# EAGLE design scarab-shield (EAGLE 8.3.1)
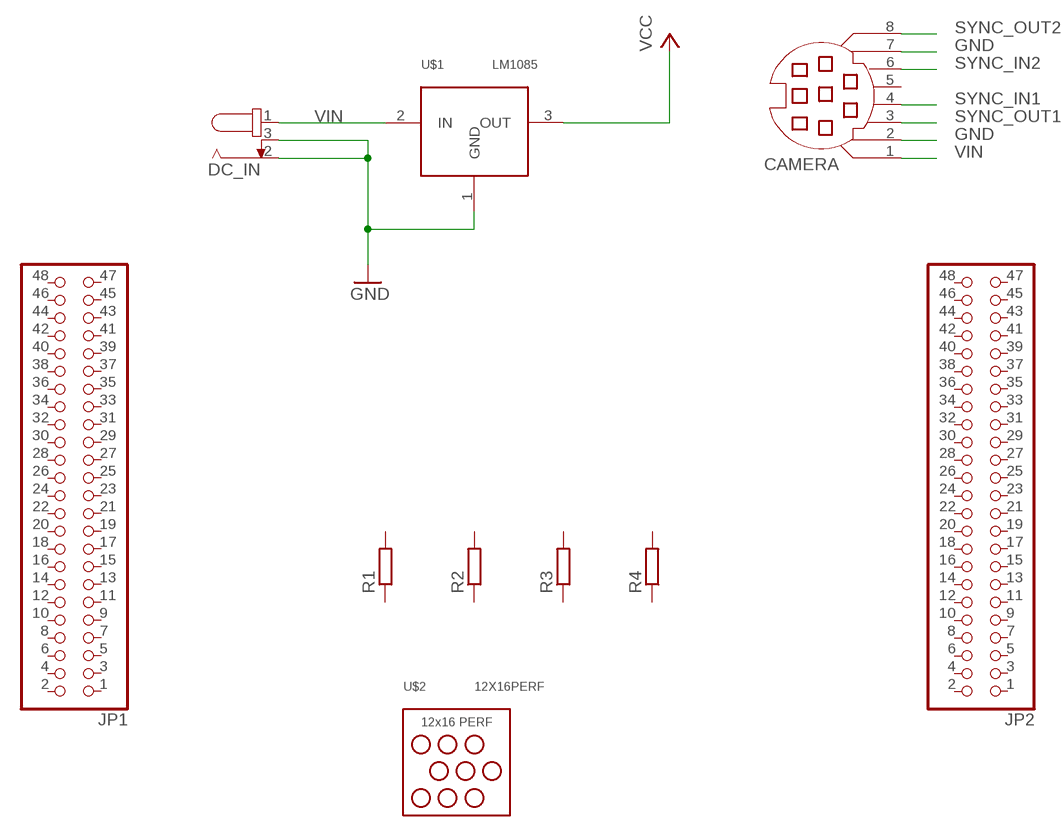
[diagram p0: schematic, sheet 1]

## Parts
CAMERA  MD08SS  [MDIN08SS]
DC_IN  694106105102  [694106105102]
JP1  PINHD-2X24  [2X24]
JP2  PINHD-2X24  [2X24]
R1  R-EU_M1206  [M1206]
R2  R-EU_M1206  [M1206]
R3  R-EU_M1206  [M1206]
R4  R-EU_M1206  [M1206]
U$1  LM1085  [TO263]
U$2  12X16PERF  [PERF-GRID]

## Nets
GND: CAMERA.2 CAMERA.7 DC_IN.2 DC_IN.3 U$1.1(GND)
SYNC_IN1: CAMERA.4
SYNC_IN2: CAMERA.6
SYNC_OUT1: CAMERA.3
SYNC_OUT2: CAMERA.8
VCC: U$1.3(OUT)
VIN: CAMERA.1 DC_IN.1 U$1.2(IN)
Unconnected: CAMERA.5 JP1.1 JP1.2 JP1.3 JP1.4 JP1.5 JP1.6 JP1.7 JP1.8 JP1.9 JP1.10 JP1.11 JP1.12 JP1.13 JP1.14 JP1.15 JP1.16 JP1.17 JP1.18 JP1.19 JP1.20 JP1.21 JP1.22 JP1.23 JP1.24 JP1.25 JP1.26 JP1.27 JP1.28 JP1.29 JP1.30 JP1.31 JP1.32 JP1.33 JP1.34 JP1.35 JP1.36 JP1.37 JP1.38 JP1.39 JP1.40 JP1.41 JP1.42 JP1.43 JP1.44 JP1.45 JP1.46 JP1.47 JP1.48 JP2.1 JP2.2 JP2.3 JP2.4 JP2.5 JP2.6 JP2.7 JP2.8 JP2.9 JP2.10 JP2.11 JP2.12 JP2.13 JP2.14 JP2.15 JP2.16 JP2.17 JP2.18 JP2.19 JP2.20 JP2.21 JP2.22 JP2.23 JP2.24 JP2.25 JP2.26 JP2.27 JP2.28 JP2.29 JP2.30 JP2.31 JP2.32 JP2.33 JP2.34 JP2.35 JP2.36 JP2.37 JP2.38 JP2.39 JP2.40 JP2.41 JP2.42 JP2.43 JP2.44 JP2.45 JP2.46 JP2.47 JP2.48 R1.1 R1.2 R2.1 R2.2 R3.1 R3.2 R4.1 R4.2

## Library data of the parts
CAMERA = con-yamaichi:MD08SS: YAMAICHI CONNECTOR; OC_FARNELL: unknown; OC_NEWARK: unknown
DC_IN = Wurth_Elektronik_Electromechanic_DC_Power_Jack_Connectors_rev15c:694106105102: WR-DC_DC Power Jack_Right Angled_SMT Center Pin Ø2.0_Plug ID Ø2.05_Plug OD Ø5.5_with Peg ;=>Code : Con_WR-DC_SMT_694106105102_694106105102 <http://katalog.we-online.de/media/images/eican/Con_WR-DC_SMT_694106105102_pf2.jpg> Details see: http://katalog.we-online.de/em/datasheet/6941xx105102.pdf Created 2014-10-08, Karrer Zheng 2014 (C) Wurth Elektronik
JP1 JP2 = pinhead:PINHD-2X24: PIN HEADER
R1-R4 = rcl:R-EU_: RESISTOR, European symbol
U$1 = custom-regs:LM1085
U$2 = custom-regs:12X16PERF

## Board
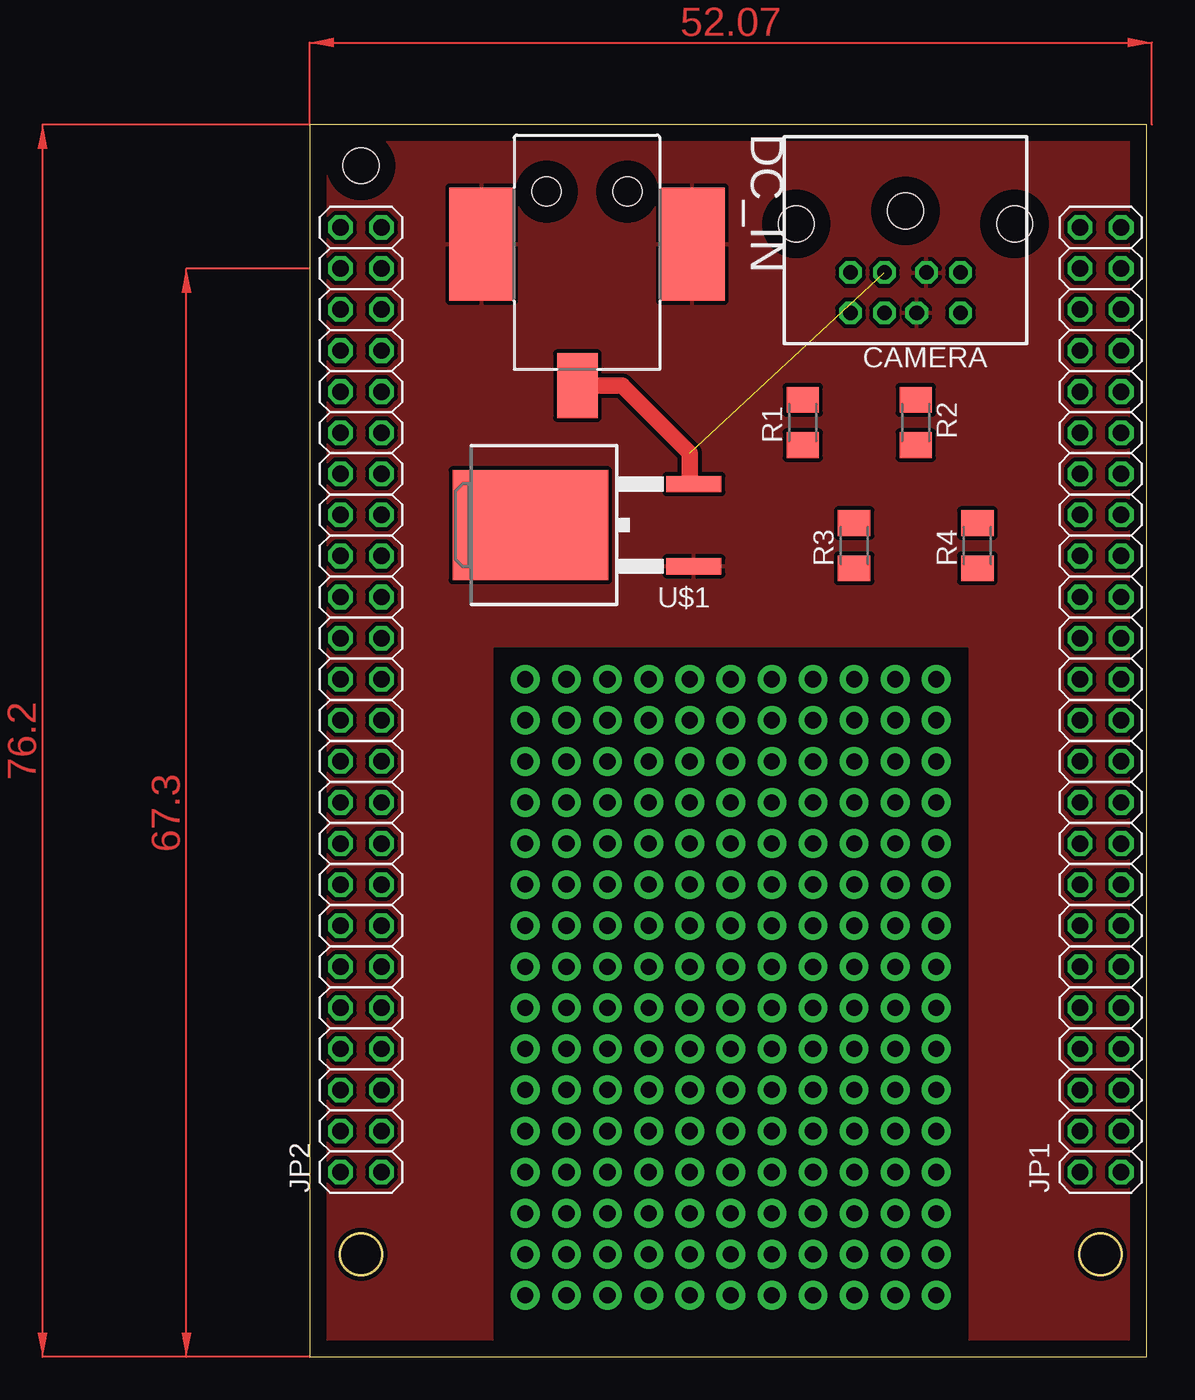
[diagram p1: board, top side]
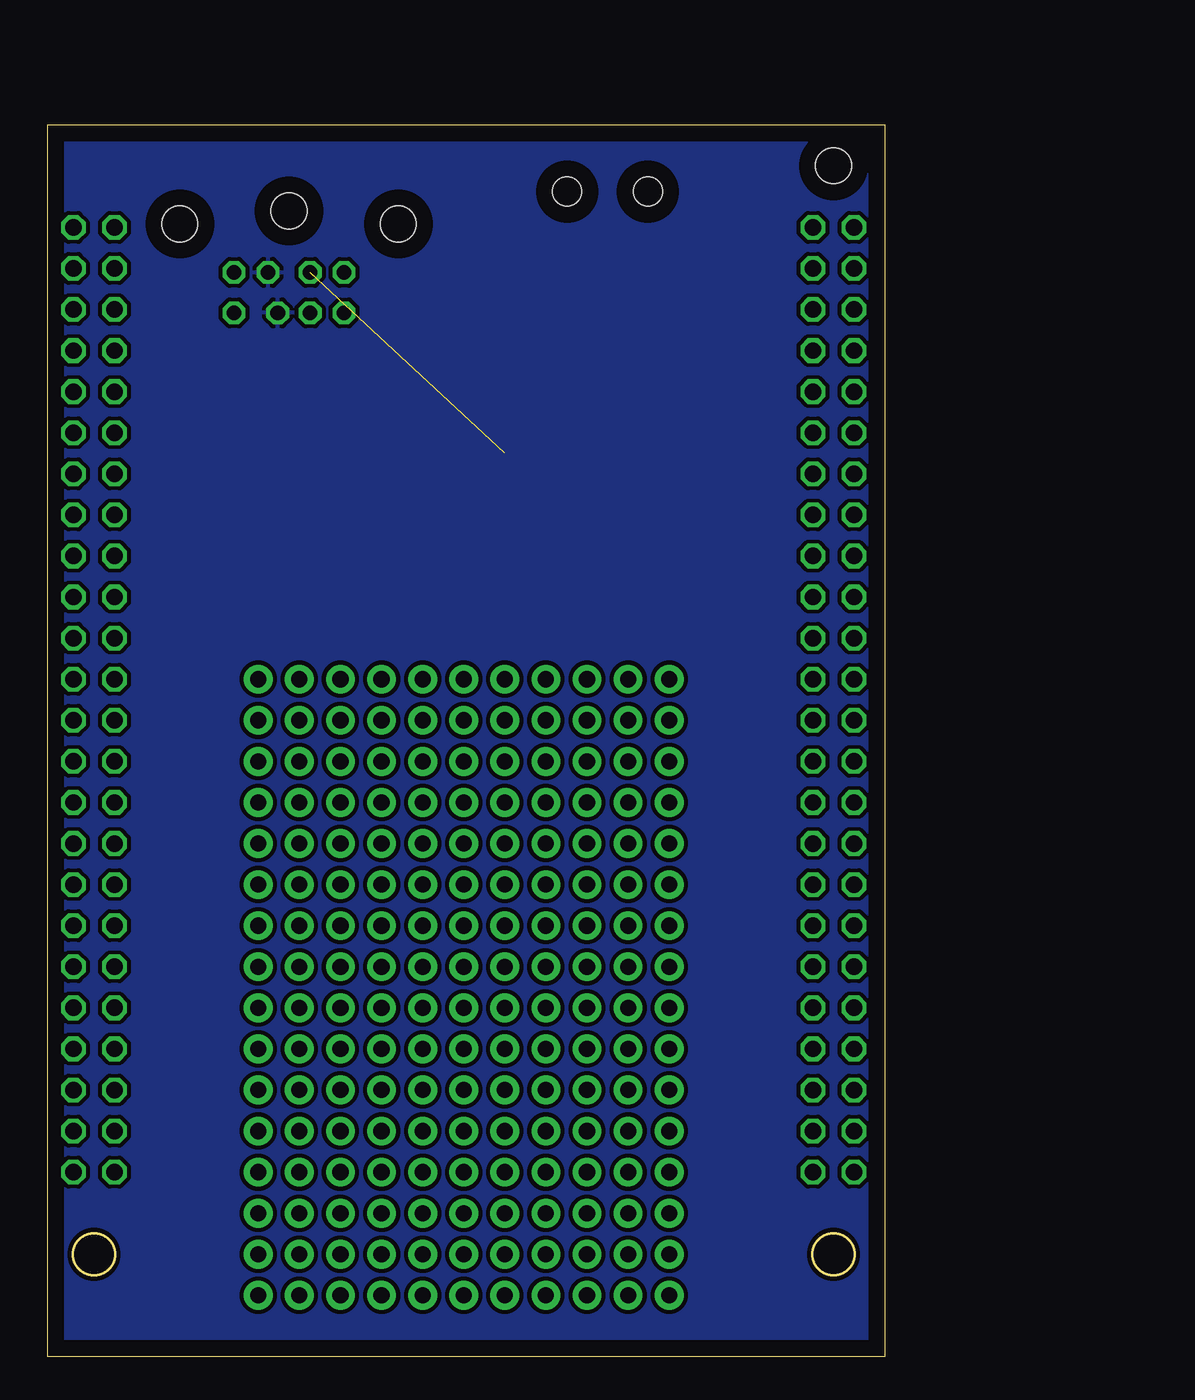
[diagram p2: board, bottom side, seen from below]

Size 51.74 x 76.19 mm. Coordinates in mm from the lower left corner, seen from the top.
Outline: 0,0 51.74,0 51.74,76.19 0,76.19 0,0
Copper layers (1*16): Top 0.035mm / dielectric 1.5mm / Bottom 0.035mm
Design rules "default": minimum track width 6mil, minimum drill 0.35mm, track to track 6mil, track to pad 6mil, pad to pad 6mil, via to via 6mil, smd to smd 6mil, copper to edge 40mil, drill to drill 6mil, minimum pad ring 10mil, minimum via ring 8mil, stop-mask expansion 4mil, vias tented up to drill 0mil, thermal gap 10mil
Holes 2.2 mm at 3.17,73.66
tRestrict: area 1.9,5.1 to 4.5,7.6; area 47.6,5.1 to 50.2,7.6
bRestrict: area 1.9,5.1 to 4.5,7.6; area 47.6,5.1 to 50.2,7.6
Milling: area 1.9,5.1 to 4.5,7.6; area 47.6,5.1 to 50.2,7.6

### Footprints (pad centres in the part's own frame; a part is rotated, then mirrored left to right if it is on the bottom)
MDIN08SS = drill 0.9 octagon: 1 1.3,8.5; 2 -1.3,8.5; 3 3.4,8.5; 4 1.3,11; 5 -3.4,8.5; 6 3.4,11; 7 -0.7,11; 8 -3.4,11 | hole 2.2: -6.75,5.5; 0,4.7; 6.75,5.5
694106105102 = smd 4 x 2.5: 1 15.5,-0.6 | smd 7 x 4: 2 6.75,6.5; 3 6.75,-6.5 | hole 1.8: 3.5,2.5; 3.5,-2.5
2X24 = drill 1.016 octagon: 1 -27.94,-1.27; 2 -27.94,1.27; 3 -25.4,-1.27; 4 -25.4,1.27; 5 -22.86,-1.27; 6 -22.86,1.27; 7 -20.32,-1.27; 8 -20.32,1.27; 9 -17.78,-1.27; 10 -17.78,1.27; 11 -15.24,-1.27; 12 -15.24,1.27; 13 -12.7,-1.27; 14 -12.7,1.27; 15 -10.16,-1.27; 16 -10.16,1.27; 17 -7.62,-1.27; 18 -7.62,1.27; 19 -5.08,-1.27; 20 -5.08,1.27; 21 -2.54,-1.27; 22 -2.54,1.27; 23 0,-1.27; 24 0,1.27; 25 2.54,-1.27; 26 2.54,1.27; 27 5.08,-1.27; 28 5.08,1.27; 29 7.62,-1.27; 30 7.62,1.27; 31 10.16,-1.27; 32 10.16,1.27; 33 12.7,-1.27; 34 12.7,1.27; 35 15.24,-1.27; 36 15.24,1.27; 37 17.78,-1.27; 38 17.78,1.27; 39 20.32,-1.27; 40 20.32,1.27; 41 22.86,-1.27; 42 22.86,1.27; 43 25.4,-1.27; 44 25.4,1.27; 45 27.94,-1.27; 46 27.94,1.27; 47 30.48,-1.27; 48 30.48,1.27
M1206 = smd 1.6 x 2: 1 -1.4,0; 2 1.4,0
TO263 = smd 1 x 3.4: 1 -2.54,-6.6; 2 2.54,-6.6 | smd 6.8 x 9.6: 3 0,3.5
PERF-GRID = drill 1 pad 1.778: P$1 -5.08,-2.54; P$2 -7.62,-2.54; P$3 -2.54,-2.54; P$4 0,-2.54; P$5 2.54,-2.54; P$6 5.08,-2.54; P$7 7.62,-2.54; P$8 10.16,-2.54; P$9 12.7,-2.54; P$10 15.24,-2.54; P$11 17.78,-2.54; P$12 -5.08,-5.08; P$13 -2.54,-5.08; P$14 0,-5.08; P$15 2.54,-5.08; P$16 5.08,-5.08; P$17 7.62,-5.08; P$18 10.16,-5.08; P$19 12.7,-5.08; P$20 15.24,-5.08; P$21 17.78,-5.08; P$22 -7.62,-5.08; P$23 -5.08,-7.62; P$24 -2.54,-7.62; P$25 0,-7.62; P$26 2.54,-7.62; P$27 5.08,-7.62; P$28 7.62,-7.62; P$29 10.16,-7.62; P$30 12.7,-7.62; P$31 15.24,-7.62; P$32 17.78,-7.62; P$33 -7.62,-7.62; P$34 -5.08,-10.16; P$35 -2.54,-10.16; P$36 0,-10.16; P$37 2.54,-10.16; P$38 5.08,-10.16; P$39 7.62,-10.16; P$40 10.16,-10.16; P$41 12.7,-10.16; P$42 15.24,-10.16; P$43 17.78,-10.16; P$44 -7.62,-10.16; P$45 -5.08,-12.7; P$46 -2.54,-12.7; P$47 0,-12.7; P$48 2.54,-12.7; P$49 5.08,-12.7; P$50 7.62,-12.7; P$51 10.16,-12.7; P$52 12.7,-12.7; P$53 15.24,-12.7; P$54 17.78,-12.7; P$55 -7.62,-12.7; P$56 -5.08,-15.24; P$57 -2.54,-15.24; P$58 0,-15.24; P$59 2.54,-15.24; P$60 5.08,-15.24; P$61 7.62,-15.24; P$62 10.16,-15.24; P$63 12.7,-15.24; P$64 15.24,-15.24; P$65 17.78,-15.24; P$66 -7.62,-15.24; P$67 -5.08,-17.78; P$68 -2.54,-17.78; P$69 0,-17.78; P$70 2.54,-17.78; P$71 5.08,-17.78; P$72 7.62,-17.78; P$73 10.16,-17.78; P$74 12.7,-17.78; P$75 15.24,-17.78; P$76 17.78,-17.78; P$77 -7.62,-17.78; P$78 -5.08,-20.32; P$79 -2.54,-20.32; P$80 0,-20.32; P$81 2.54,-20.32; P$82 5.08,-20.32; P$83 7.62,-20.32; P$84 10.16,-20.32; P$85 12.7,-20.32; P$86 15.24,-20.32; P$87 17.78,-20.32; P$88 -7.62,-20.32; P$89 -5.08,-22.86; P$90 -2.54,-22.86; P$91 0,-22.86; P$92 2.54,-22.86; P$93 5.08,-22.86; P$94 7.62,-22.86; P$95 10.16,-22.86; P$96 12.7,-22.86; P$97 15.24,-22.86; P$98 17.78,-22.86; P$99 -7.62,-22.86; P$100 -5.08,-25.4; P$101 -2.54,-25.4; P$102 0,-25.4; P$103 2.54,-25.4; P$104 5.08,-25.4; P$105 7.62,-25.4; P$106 10.16,-25.4; P$107 12.7,-25.4; P$108 15.24,-25.4; P$109 17.78,-25.4; P$110 -7.62,-25.4; P$111 -5.08,-27.94; P$112 -2.54,-27.94; P$113 0,-27.94; P$114 2.54,-27.94; P$115 5.08,-27.94; P$116 7.62,-27.94; P$117 10.16,-27.94; P$118 12.7,-27.94; P$119 15.24,-27.94; P$120 17.78,-27.94; P$121 -7.62,-27.94; P$122 -5.08,-30.48; P$123 -2.54,-30.48; P$124 0,-30.48; P$125 2.54,-30.48; P$126 5.08,-30.48; P$127 7.62,-30.48; P$128 10.16,-30.48; P$129 12.7,-30.48; P$130 15.24,-30.48; P$131 17.78,-30.48; P$132 -7.62,-30.48; P$133 -5.08,-33.02; P$134 -2.54,-33.02; P$135 0,-33.02; P$136 2.54,-33.02; P$137 5.08,-33.02; P$138 7.62,-33.02; P$139 10.16,-33.02; P$140 12.7,-33.02; P$141 15.24,-33.02; P$142 17.78,-33.02; P$143 -7.62,-33.02; P$144 -5.08,-35.56; P$145 -2.54,-35.56; P$146 0,-35.56; P$147 2.54,-35.56; P$148 5.08,-35.56; P$149 7.62,-35.56; P$150 10.16,-35.56; P$151 12.7,-35.56; P$152 15.24,-35.56; P$153 17.78,-35.56; P$154 -7.62,-35.56; P$155 -5.08,-38.1; P$156 -2.54,-38.1; P$157 0,-38.1; P$158 2.54,-38.1; P$159 5.08,-38.1; P$160 7.62,-38.1; P$161 10.16,-38.1; P$162 12.7,-38.1; P$163 15.24,-38.1; P$164 17.78,-38.1; P$165 -7.62,-38.1; P$166 -5.08,-40.64; P$167 -2.54,-40.64; P$168 0,-40.64; P$169 2.54,-40.64; P$170 5.08,-40.64; P$171 7.62,-40.64; P$172 10.16,-40.64; P$173 12.7,-40.64; P$174 15.24,-40.64; P$175 17.78,-40.64; P$176 -7.62,-40.64

### Placement (x,y rotation side)
CAMERA  36.83,75.56 180 top
DC_IN  17.14,75.56 270 top
JP1  48.9,39.37 90 top
JP2  3.17,39.37 90 top
R1  30.48,57.78 90 top
R2  37.47,57.78 270 top
R3  33.66,50.16 90 top
R4  41.27,50.16 90 top
U$1  17.14,51.44 90 top
U$2  20.95,44.45 0 top

### Tracks (layer width: path | path; a pad name or v marks a point on that pad's centre or on a via)
GND
  pour Top (isolate 0.254): 0,76.2 52.07,76.2 52.07,0 0,0
  pour Bottom (isolate 0.254): 0,76.2 0,0 52.07,0 52.07,76.2
N$2
  cutout Top: 11.43,43.81 40.64,43.81 40.64,0.64 11.43,0.64
VIN  (1 unrouted)
  Top 1.016: DC_IN.1 19.31,60.06 23.5,55.88 23.5,54.23 U$1.2
(copper drawn outside any net)
  shapes: Top area x3